# Altium schematic sheet HDMI_con.SchDoc
size 311 x 223 mm
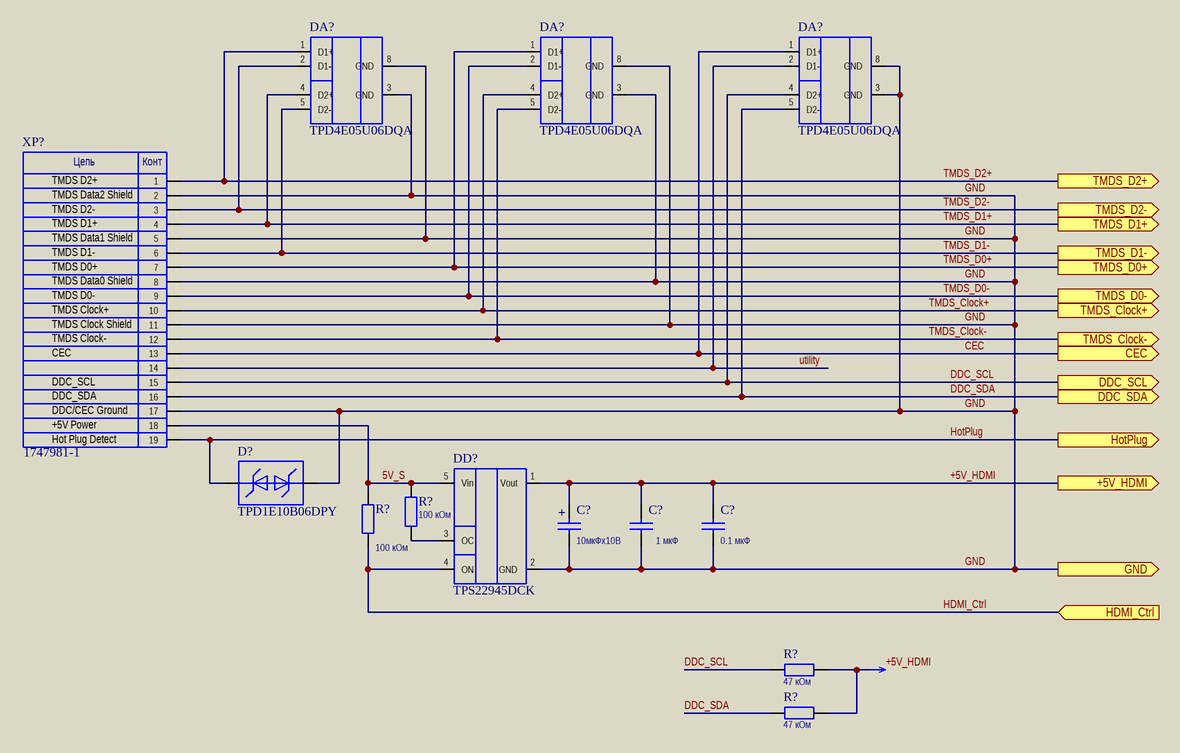
[diagram p0: HDMI_con.SchDoc]

## Parts
(Parts that share a designator on the sheet are numbered #1, #2 ... from top to bottom, then left to right.)
C?#1  value 10мкФx10В  [ChipA]  (hidden comment: CP)
C?#2  value 1 мкФ  [Chip0603]  (hidden comment: C)
C?#3  value 0.1 мкФ  [Chip0603]  (hidden comment: C)
D?  TPD1E10B06DPY  [X1SON]
DA?#1  TPD4E05U06DQA  [USON10]
DA?#2  TPD4E05U06DQA  [USON10]
DA?#3  TPD4E05U06DQA  [USON10]
DD?  TPS22945DCK  [SC-70]
R?#1  100 кОм  [Res0603]
R?#2  100 кОм  [Res0603]
R?#3  47 кОм  [Res0603]
R?#4  47 кОм  [Res0603]
XP?  1747981-1  [1747981-1]

## Ports
+5V_HDMI (out), CEC (out), DDC_SCL (out), DDC_SDA (out), GND (out), HDMI_Ctrl (in), HotPlug (out), TMDS_Clock+ (out), TMDS_Clock- (out), TMDS_D0+ (out), TMDS_D0- (out), TMDS_D1+ (out), TMDS_D1- (out), TMDS_D2+ (out), TMDS_D2- (out)

## Nets
5V_S: DD?.5(Vin) R?#1.2 R?#2.2 XP?.18
+5V_HDMI: C?#1.1 C?#2.1 C?#3.1 DD?.1(Vout) R?#3.1 R?#4.1 ; port +5V_HDMI
CEC: DA?#3.1(D1+) XP?.13 ; port CEC
DDC_SCL: DA?#3.4(D2+) R?#3.2 XP?.15 ; port DDC_SCL
DDC_SDA: DA?#3.5(D2-) R?#4.2 XP?.16 ; port DDC_SDA
GND: C?#1.2 C?#2.2 C?#3.2 D?.1 DA?#1.3(GND) DA?#1.8(GND) DA?#2.3(GND) DA?#2.8(GND) DA?#3.3(GND) DA?#3.8(GND) DD?.2(GND) XP?.2 XP?.5 XP?.8 XP?.11 XP?.17 ; port GND
HDMI_Ctrl: DD?.4(ON) R?#2.1 ; port HDMI_Ctrl
HotPlug: D?.2 XP?.19 ; port HotPlug
TMDS_Clock+: DA?#2.4(D2+) XP?.10 ; port TMDS_Clock+
TMDS_Clock-: DA?#2.5(D2-) XP?.12 ; port TMDS_Clock-
TMDS_D0+: DA?#2.1(D1+) XP?.7 ; port TMDS_D0+
TMDS_D0-: DA?#2.2(D1-) XP?.9 ; port TMDS_D0-
TMDS_D1+: DA?#1.4(D2+) XP?.4 ; port TMDS_D1+
TMDS_D1-: DA?#1.5(D2-) XP?.6 ; port TMDS_D1-
TMDS_D2+: DA?#1.1(D1+) XP?.1 ; port TMDS_D2+
TMDS_D2-: DA?#1.2(D1-) XP?.3 ; port TMDS_D2-
utility: DA?#3.2(D1-) XP?.14
NetDD?_3: DD?.3(OC) R?#1.1

Not connected (* = marked no-connect by the designer): DA?#1 6(nc) 7(nc) 9(nc) 10(nc); DA?#2 6(nc) 7(nc) 9(nc) 10(nc); DA?#3 6(nc) 7(nc) 9(nc) 10(nc)

## Notes on the sheet
- TMDS D2+
- (near XP?) TMDS Data2 Shield
- TMDS D2-
- TMDS D1+
- (near XP?) TMDS Data1 Shield
- TMDS D1-
- TMDS D0+
- (near XP?) TMDS Data0 Shield
- TMDS D0-
- (near XP?) TMDS Clock+
- (near XP?) TMDS Clock Shield
- (near XP?) TMDS Clock-
- CEC
- DDC_SCL
- DDC_SDA
- (near XP?) DDC/CEC Ground
- +5V Power
- (near XP?) Hot Plug Detect
- Перв. примен.
- М. экспертиза
- Справ. №
- Подп. и дата
- Инв. № дубл.
- Взам. инв. №
- Изм.
- Разраб.
- Лист.
- № докум.
- Подп.
- Дата
- Лит.
- Масса
- Масш.
- Инв. № подп.
- Пров.
- Т. контр.
- Н. контр.
- Утв.
- Схема электрическая
- принципиальная
- Лист
- Листов
- Копировал
- Формат А2
- (in symbol CON_19) Цепь; Конт
- (in symbol CP) +

## Library data of the parts
C?#1 = CP: Manufacturer: Any; Class: Capacitors; SubClass: Polar; Name: TPSA106K010R0900; Author: Harry E. Zhurov
C?#2 C?#3 = C: Manufacturer: Any; SubClass: General Purpose; Class: Capacitors; Author: Harry E. Zhurov
D? = TPD1E10B06: Single-Channel ESD Protection Diode in 0402 Package; Name: TPD1E10B06DPY
DA?#1-DA?#3 = TPD4E05U06DQA: 4 Channel ESD Protection Device for Super-Speed (Up to 6 Gbps)  Interface; Name: TPD4E05U06DQA
DD? = TPS22945DCKR: Name: TPS22945DCK
R?#1-R?#4 = R: Manufacturer: Any; Class: Resistor; SubClass: Constant
  R?#1 R?#2: Value: 100 кОм
  R?#3 R?#4: Value: 47 кОм
XP? = CON_19: HDMI connector; Name: 1747981-1